# Altium schematic sheet H-BRIDGE.SchDoc
size A; SheetNumber: 1; SheetTotal: 1; SPICEModelCacheLLRTCEIW: <root> / <DocumentId>LLRTCEIW</DocumentId> / <CacheFrame Number="0"> / <Model Name="irf1010" Kind="CKT"> / <Text>*IRF1010 MCE 4-2-96 / *55V  75A .014 ohm HEXFET pkg:TO-220 2,1,3 / .SUBCKT IRF1010  10 20 40 40 / M1   1  2  3  3  DMOS L=1U W=1U / RD  10  1  5.65M / RS  30  3  1.35M / RG  20  2  12.1 / CGS  2  3  2.15N / EGD 12  0  2  1  1 / VFB 14  0  0 / FFB  2  1  VFB  1 / CGD 13 14  4.49N / R1  13  0  1 / D1  12 13  DLIM / DDG 15 14  DCGD / R2  12 15  1 / D2  15  0  DLIM / DSD  3 10  DSUB / LS  30 40  7.5N / .MODEL DMOS NMOS (LEVEL=3 THETA=60M VMAX=114K ETA=2M VTO=3 KP=19.4) / .MODEL DCGD D (CJO=4.49N VJ=.6 M=.68) / .MODEL DSUB D (IS=311N N=1.5 RS=8.67M BV=55 CJO=4.08N VJ=.8 M=.42 TT=100N) / .MODEL DLIM D (IS=100U) / .ENDS IRF1010</Text> / </Model> / <Model Name="irf9510" Kind="CKT"> / <Text>*IRF9510  MCE  4-2-96 / *100V  4A  1.2 ohms HEXFET pkg:TO-220 2,1,3 / .SUBCKT IRF9510  10 20 40 40 / M1   1  2  3  3  DMOS L=1U W=1U / RD  10  1  .569 / RS  30  3  31M / RG  20  2  37.5 / CGS  2  3  182P / EGD 12  0  1  2  1 / VFB 14  0  0 / FFB  1  2  VFB  1 / CGD 13 14  231P / R1  13  0  1 / D1  12 13  DLIM / DDG 15 14  DCGD / R2  12 15  1 / D2  15  0  DLIM / DSD 10  3  DSUB / LS  30 40  7.5N / .MODEL DMOS PMOS (LEVEL=3 THETA=60M VMAX=208K ETA=2M VTO=-3 KP=.471) / .MODEL DCGD D (CJO=231P VJ=.6 M=.68) / .MODEL DSUB D (IS=16.6N N=1.5 RS=1.18 BV=100 CJO=327P VJ=.8 M=.42 TT=82N) / .MODEL DLIM D (IS=100U) / .ENDS IRF9510</Text> / </Model> / </CacheFrame> / </root>
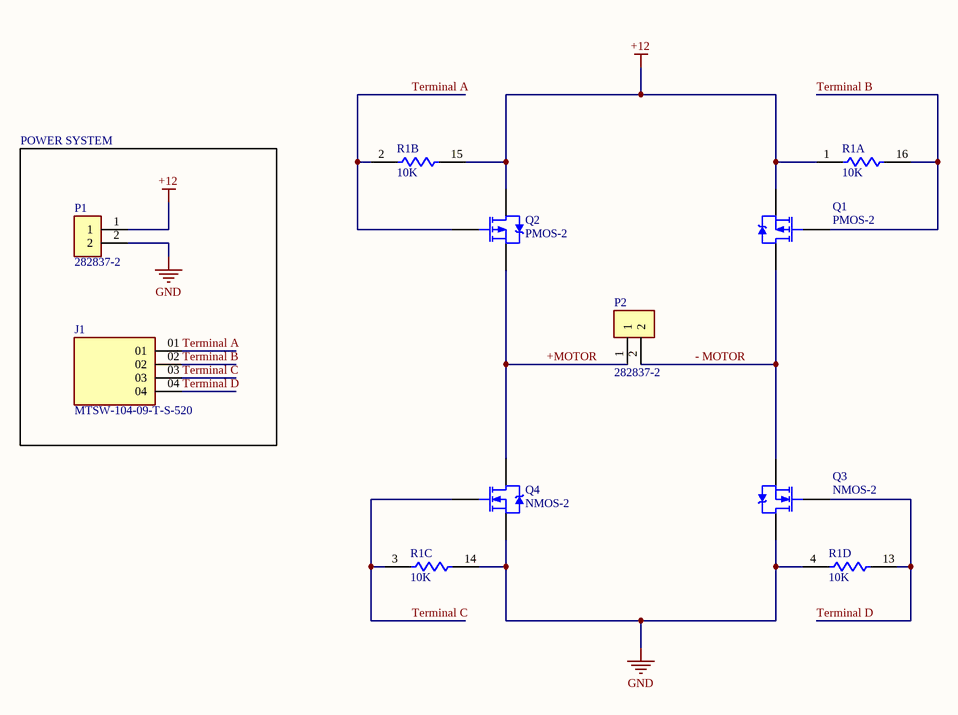
[diagram p0: H-BRIDGE.SchDoc]

## Parts
J1  MTSW-104-09-T-S-520  [SAMTEC_MTSW-104-09-T-S-520]
P1  282837-2  [TE_282837-2]
P2  282837-2  [TE_282837-2]
Q1  PMOS-2  [TO-220AB]
Q2  PMOS-2  [TO-220AB]
Q3  NMOS-2  [TO-220AB]
Q4  NMOS-2  [TO-220AB]
R1  value 10K  [SOIC16_N]  (hidden comment: Res Pack1)  (parts A,B,C,D of 8)

## Blocks framed on the sheet
POWER SYSTEM: J1 P1

## Nets
+12: P1.1 Q1.3(S) Q2.2(D) R1.1 R1.15
GND: P1.2 Q3.2(D) Q4.3(S) R1.4 R1.14
+MOTOR: P2.1 Q2.3(S) Q4.2(D)
- MOTOR: P2.2 Q1.2(D) Q3.3(S)
Terminal A: J1.01 Q2.1(G) R1.2
Terminal B: J1.02 Q1.1(G) R1.16
Terminal C: J1.03 Q4.1(G) R1.3
Terminal D: J1.04 Q3.1(G) R1.13

## Library data of the parts
P1 P2 = 282837-2: Ð Ð°Ð·ÑŠÐµÐ¼Ð½Ñ‹Ðµ ÐºÐ»ÐµÐ¼Ð¼Ð½Ñ‹Ðµ ÐºÐ¾Ð»Ð¾Ð´ÐºÐ¸ Ð Ð¾Ð·ÐµÑ‚ÐºÐ° 2 Ð¿Ð¾Ð»Ð¾Ð¶ÐµÐ½Ð¸Ñ 5,08 Ð¼Ð¼ ÐŸÑ€Ð¸Ð¿Ð¾Ð¹ Ð¿Ñ€ÑÐ¼Ð¾Ð¹ Ñ‡ÐµÑ€ÐµÐ· Ð¾Ñ‚Ð²ÐµÑ€ÑÑ‚Ð¸Ðµ 13,5 Ð / ÐºÐ¾Ð½Ñ‚Ð°ÐºÑ‚; MF: TE Connectivity; SnapEDA_Link: https://www.snapeda.com/parts/282837-2/TE+Connectivity+AMP+Connectors/view-part/?ref=snap; Price: None; Check_prices: https://www.snapeda.com/parts/282837-2/TE+Connectivity+AMP+Connectors/view-part/?ref=eda; Purchase-URL: https://pricing.snapeda.com/search/part/282837-2/?ref=eda; MP: 282837-2; Value: *; Availability: In Stock; Package: None
Q1 Q2 = PMOS-2: P-Channel Power MOSFET; Note: Pin 4 not drawn and electrically connected to Pin 2.; Published: 8-Jun-2000; LatestRevisionDate: 17-Jul-2002; LatestRevisionNote: Re-released for DXP Platform.; DatasheetVersion: PD-9.390D; PackageVersion: Feb-1997; PackageReference: TO-220AB; Publisher: Altium Limited; PackageDescription: TO, Thru-Hole, Vertical, Heatsink Mounted; 3 In-Line Leads; Pitch 2.54 mm; ComponentLink1Description: Manufacturer Link; ComponentLink1URL: http://www.irf.com/
Q3 Q4 = NMOS-2: N-Channel Power MOSFET; Note: Pin 2 is electrically connected to pin 4.; Published: 8-Jun-2000; LatestRevisionDate: 17-Jul-2002; LatestRevisionNote: Re-released for DXP Platform.; DatasheetVersion: PD-9.814; PackageVersion: Feb-1997; PackageReference: TO-220AB; Publisher: Altium Limited; PackageDescription: TO, Thru-Hole, Vertical, Heatsink Mounted; 3 In-Line Leads; Pitch 2.54 mm; ComponentLink1Description: Manufacturer Link; ComponentLink1URL: http://www.irf.com/
R1 = Res Pack1: Isolated Resistor Network - Parts; Sim Note: Enter the Resistance value into parameter field.; Published: 24-Mar-1999; LatestRevisionDate: 29-May-2009; LatestRevisionNote: IPC-7351 Footprint Added.; PackageReference: SOIC16; Publisher: Altium Limited; PackageDescription: 16-Pin Small Outline Integrated Circuit 1.27 mm Pitch; Code_JEDEC: MS-012-AC; Code_IPC: SOIC127P600-16
J1 = MTSW-104-09-T-S-520: Package: None; MP: MTSW-104-09-T-S-520; Price: None; Availability: Unavailable; Value: *